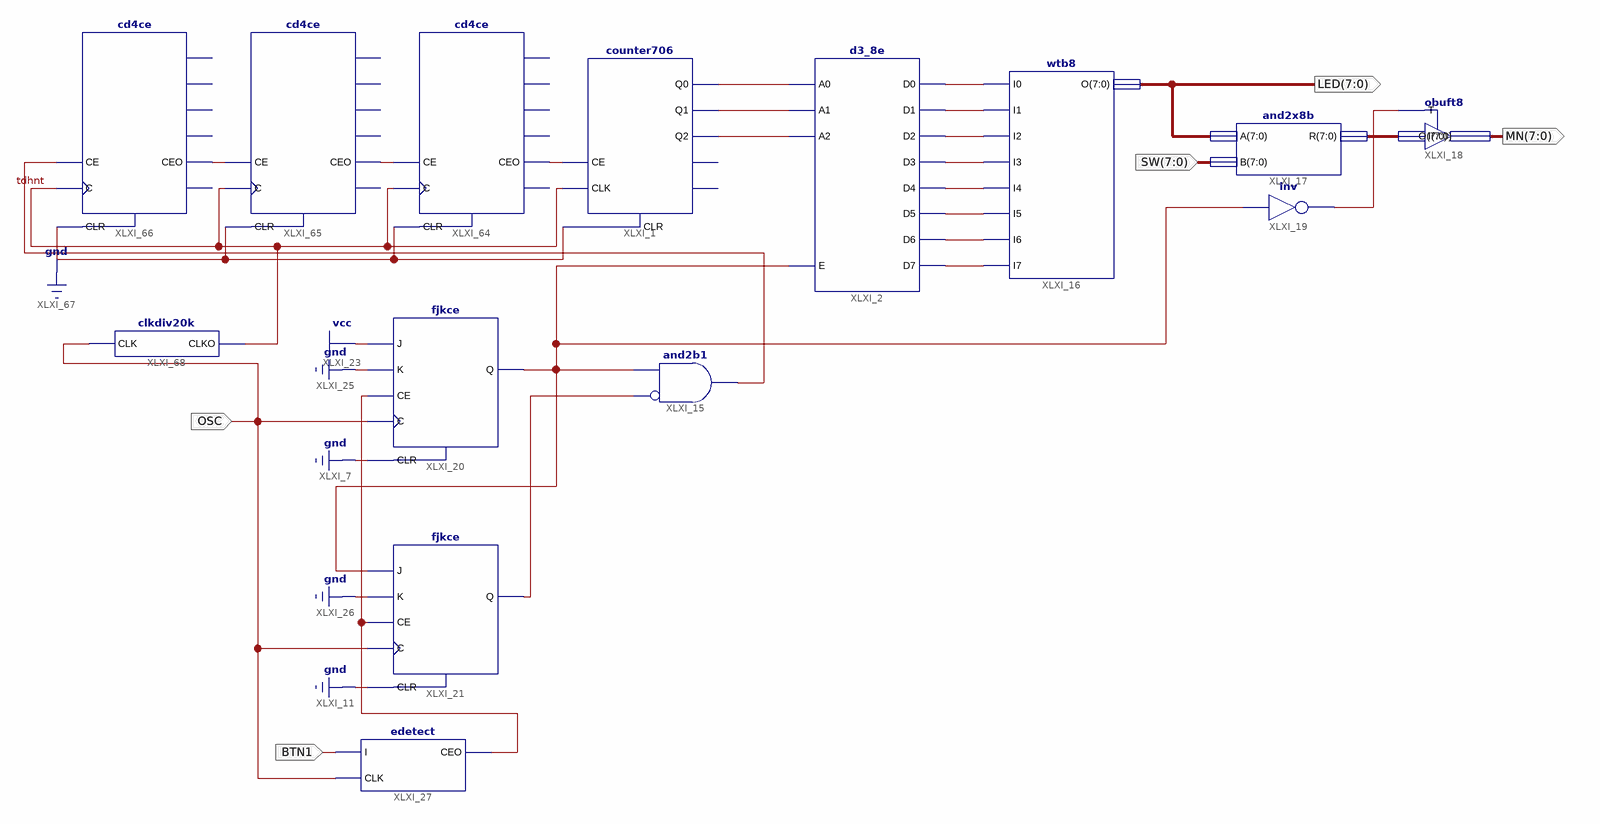
[diagram p0: schematic sheet 1]
// Xilinx ISE schematic main.sch (spartan6) as structural Verilog: 14 symbols, 5 ports
module main (
  input  OSC,
  input  [7:0] SW,
  input  BTN1,
  output [7:0] LED,
  output [7:0] MN
);

  wire tdhnt, XLXN_1, XLXN_2, XLXN_3, XLXN_22, XLXN_24, XLXN_25, XLXN_26, XLXN_28, XLXN_29, XLXN_30, XLXN_31,
       XLXN_32, XLXN_33, XLXN_41, XLXN_51, XLXN_124, XLXN_126, XLXN_127, XLXN_128;
  wire [7:0] XLXN_39;

  counter706 XLXI_1 (.CE(XLXN_127), .CLK(tdhnt), .CLR(1'b0), .Q0(XLXN_1), .Q1(XLXN_2), .Q2(XLXN_3));  // open: CEO, TC
  wtb8 XLXI_16 (
    .I0(XLXN_25), .I1(XLXN_26), .I2(XLXN_28), .I3(XLXN_29), .I4(XLXN_30), .I5(XLXN_31), .I6(XLXN_32),
    .I7(XLXN_33), .O(LED));
  d3_8e XLXI_2 (
    .A0(XLXN_1), .A1(XLXN_2), .A2(XLXN_3), .E(XLXN_24), .D0(XLXN_25), .D1(XLXN_26), .D2(XLXN_28),
    .D3(XLXN_29), .D4(XLXN_30), .D5(XLXN_31), .D6(XLXN_32), .D7(XLXN_33));
  and2x8b XLXI_17 (.A(LED), .B(SW), .R(XLXN_39));
  obuft8 XLXI_18 (.I(XLXN_39), .T(XLXN_41), .O(MN));
  not XLXI_19 (XLXN_41, XLXN_24);
  fjkce XLXI_20 (.C(OSC), .CE(XLXN_51), .CLR(1'b0), .J(1'b1), .K(1'b0), .Q(XLXN_24));
  fjkce XLXI_21 (.C(OSC), .CE(XLXN_51), .CLR(1'b0), .J(XLXN_24), .K(1'b0), .Q(XLXN_22));
  and XLXI_15 (XLXN_128, ~XLXN_22, XLXN_24);  // and2b1
  edetect XLXI_27 (.CEO(XLXN_51), .CLK(OSC), .I(BTN1));
  cd4ce XLXI_64 (.C(tdhnt), .CE(XLXN_126), .CLR(1'b0), .CEO(XLXN_127));  // open: Q0, Q1, Q2, Q3, TC
  cd4ce XLXI_65 (.C(tdhnt), .CE(XLXN_124), .CLR(1'b0), .CEO(XLXN_126));  // open: Q0, Q1, Q2, Q3, TC
  cd4ce XLXI_66 (.C(tdhnt), .CE(XLXN_128), .CLR(1'b0), .CEO(XLXN_124));  // open: Q0, Q1, Q2, Q3, TC
  clkdiv20k XLXI_68 (.CLK(OSC), .CLKO(tdhnt));
endmodule
